# EAGLE design TurnoutModule (EAGLE 7.6.0)
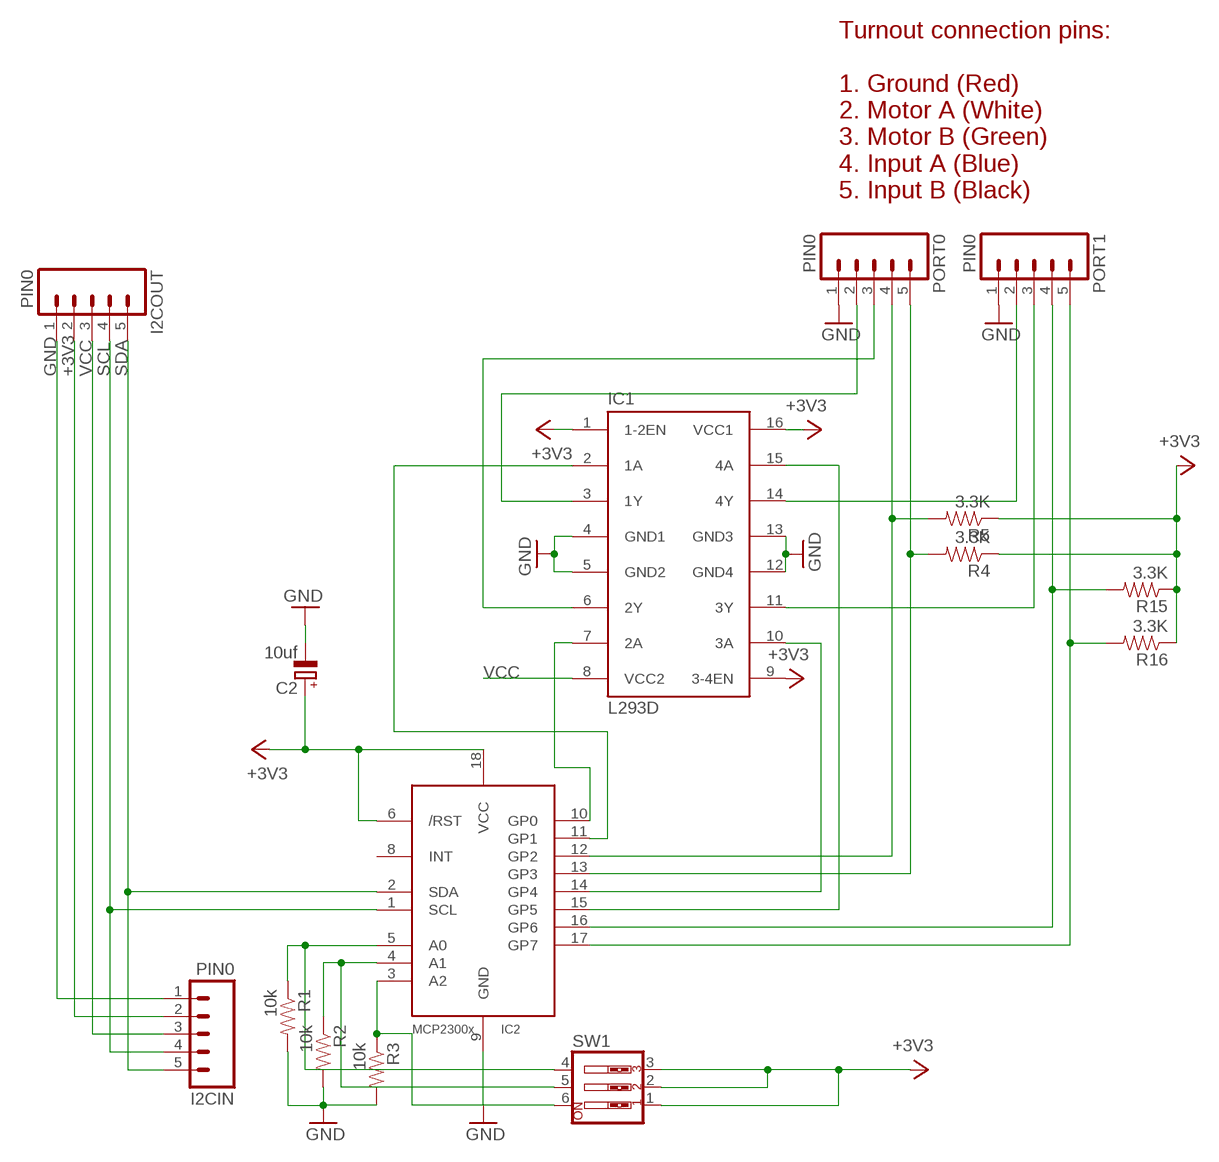
[diagram p0: schematic, sheet 1]

## Parts
C2  10uf  CPOL-EUE2.5-6  [E2,5-6]
I2CIN  PIN0  M05  [05P]
I2COUT  PIN0  M05  [05P]
IC1  L293D  [DIL16]
IC2  MCP23008/P  [DIL18]
PORT0  PIN0  M05  [05P]
PORT1  PIN0  M05  [05P]
R1  10k  RESISTORPTH-1/4W  [AXIAL-0.4]
R2  10k  RESISTORPTH-1/4W  [AXIAL-0.4]
R3  10k  RESISTORPTH-1/4W  [AXIAL-0.4]
R4  3.3K  RESISTORPTH-1/4W  [AXIAL-0.4]
R5  3.3K  RESISTORPTH-1/4W  [AXIAL-0.4]
R15  3.3K  RESISTORPTH-1/4W  [AXIAL-0.4]
R16  3.3K  RESISTORPTH-1/4W  [AXIAL-0.4]
SW1  SW_DIP-3  [EDG-03]

## Nets
+3V3: C2.+ I2CIN.2 I2COUT.2 IC1.1(1-2EN) IC1.9(3-4EN) IC1.16(VCC1) IC2.6(/RST) IC2.18(VCC) R4.P$1 R5.P$1 R15.P$1 R16.P$1 SW1.1 SW1.2 SW1.3
GND: C2.- I2CIN.1 I2COUT.1 IC1.4(GND1) IC1.5(GND2) IC1.12(GND4) IC1.13(GND3) IC2.9(GND) PORT0.1 PORT1.1 R1.P$2 R2.P$2 R3.P$2
N$1: IC2.5(A0) R1.P$1 SW1.4
N$2: IC2.17(GP7) PORT1.5 R16.P$2
N$3: IC1.3(1Y) PORT0.2
N$4: IC2.4(A1) R2.P$1 SW1.5
N$5: IC2.16(GP6) PORT1.4 R15.P$2
N$6: IC1.6(2Y) PORT0.3
N$7: IC2.3(A2) R3.P$1 SW1.6
N$8: IC1.7(2A) IC2.10(GP0)
N$9: IC1.2(1A) IC2.11(GP1)
N$10: IC1.14(4Y) PORT1.2
N$12: IC2.12(GP2) PORT0.4 R5.P$2
N$13: IC1.11(3Y) PORT1.3
N$15: IC1.10(3A) IC2.14(GP4)
N$17: IC1.15(4A) IC2.15(GP5)
N$29: IC2.13(GP3) PORT0.5 R4.P$2
SCL: I2CIN.4 I2COUT.4 IC2.1(SCL)
SDA: I2CIN.5 I2COUT.5 IC2.2(SDA)
VCC: I2CIN.3 I2COUT.3 IC1.8(VCC2)
Unconnected: IC2.8(INT)

## Notes on the sheet
- Turnout connection pins:
  
  1. Ground (Red)
  2. Motor A (White)
  3. Motor B (Green)
  4. Input A (Blue)
  5. Input B (Black)

## Library data of the parts
C2 = rcl:CPOL-EU: POLARIZED CAPACITOR, European symbol
I2CIN I2COUT PORT0 PORT1 = con-amp-quick:M05: AMP QUICK CONNECTOR; OC_FARNELL: unknown; OC_NEWARK: unknown
IC1 = st-microelectronics:L293D: PUSH-PULL 4 CHANNEL DRIVER; MPN: L293D; OC_FARNELL: 9589619; OC_NEWARK: 56P8249
IC2 = adafruit:MCP23008: MCP23008 Inexpensive i2c i/o expander - 8 general purpose i/o pins with optional pullups
R1-R5 R15 R16 = SparkFun-Resistors:RESISTOR: Resistor Basic schematic elements and footprints for 0603, 1206, and PTH resistors.
SW1 = special:SW_DIP-3: DIP SWITCH

## Board
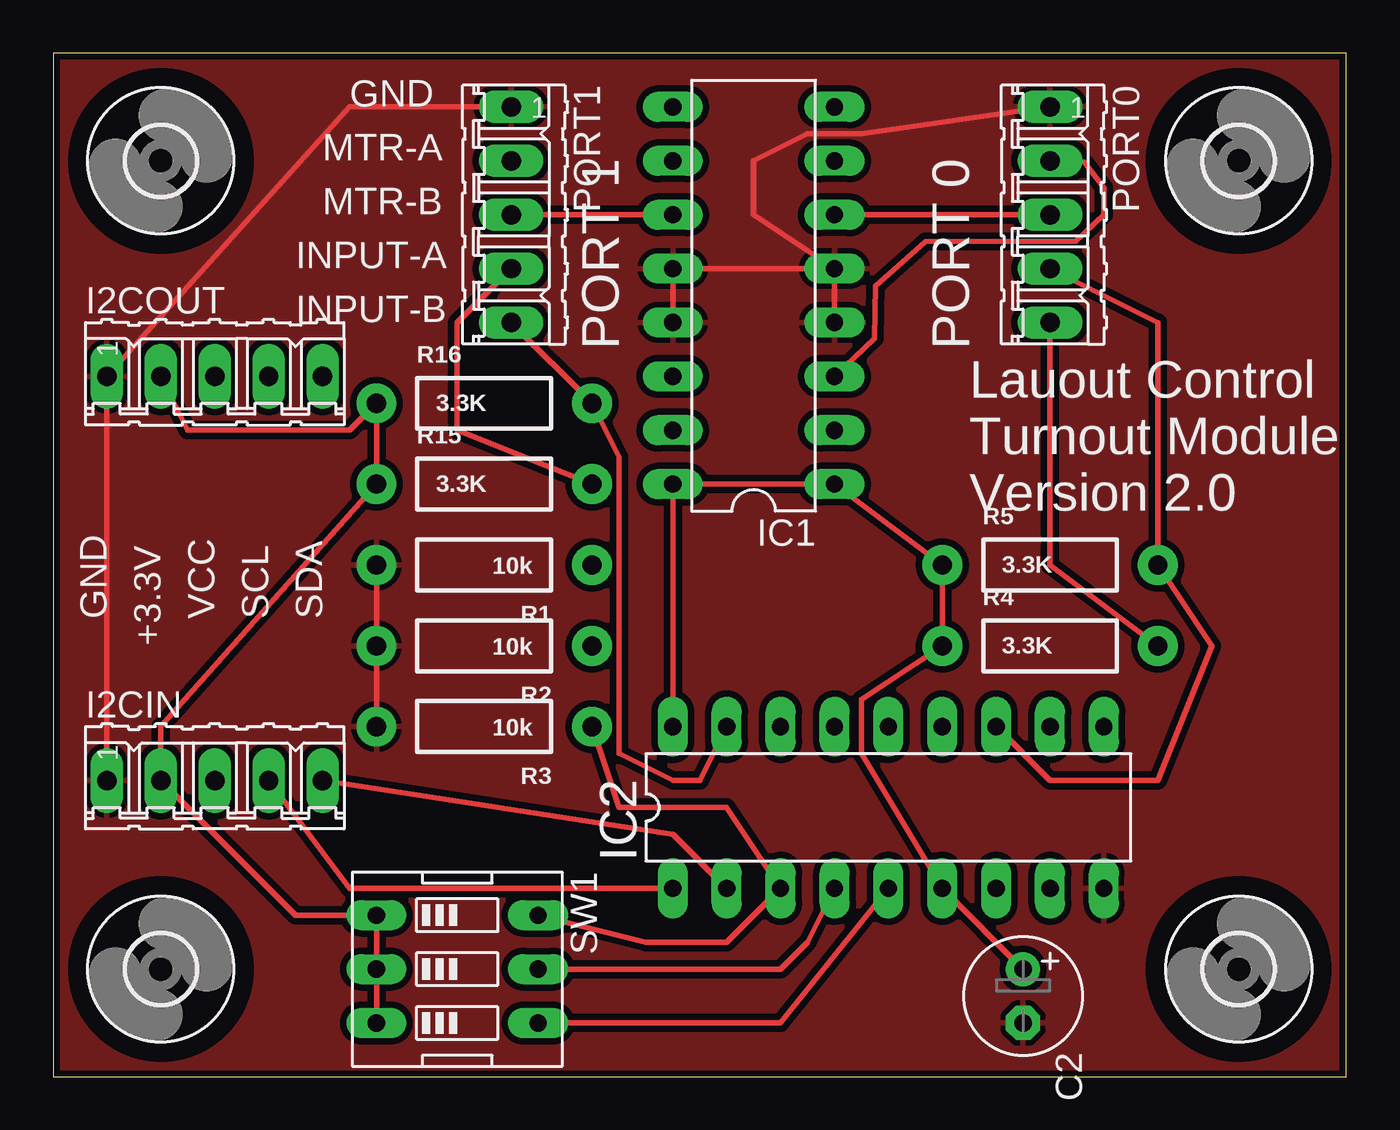
[diagram p1: board, top side]
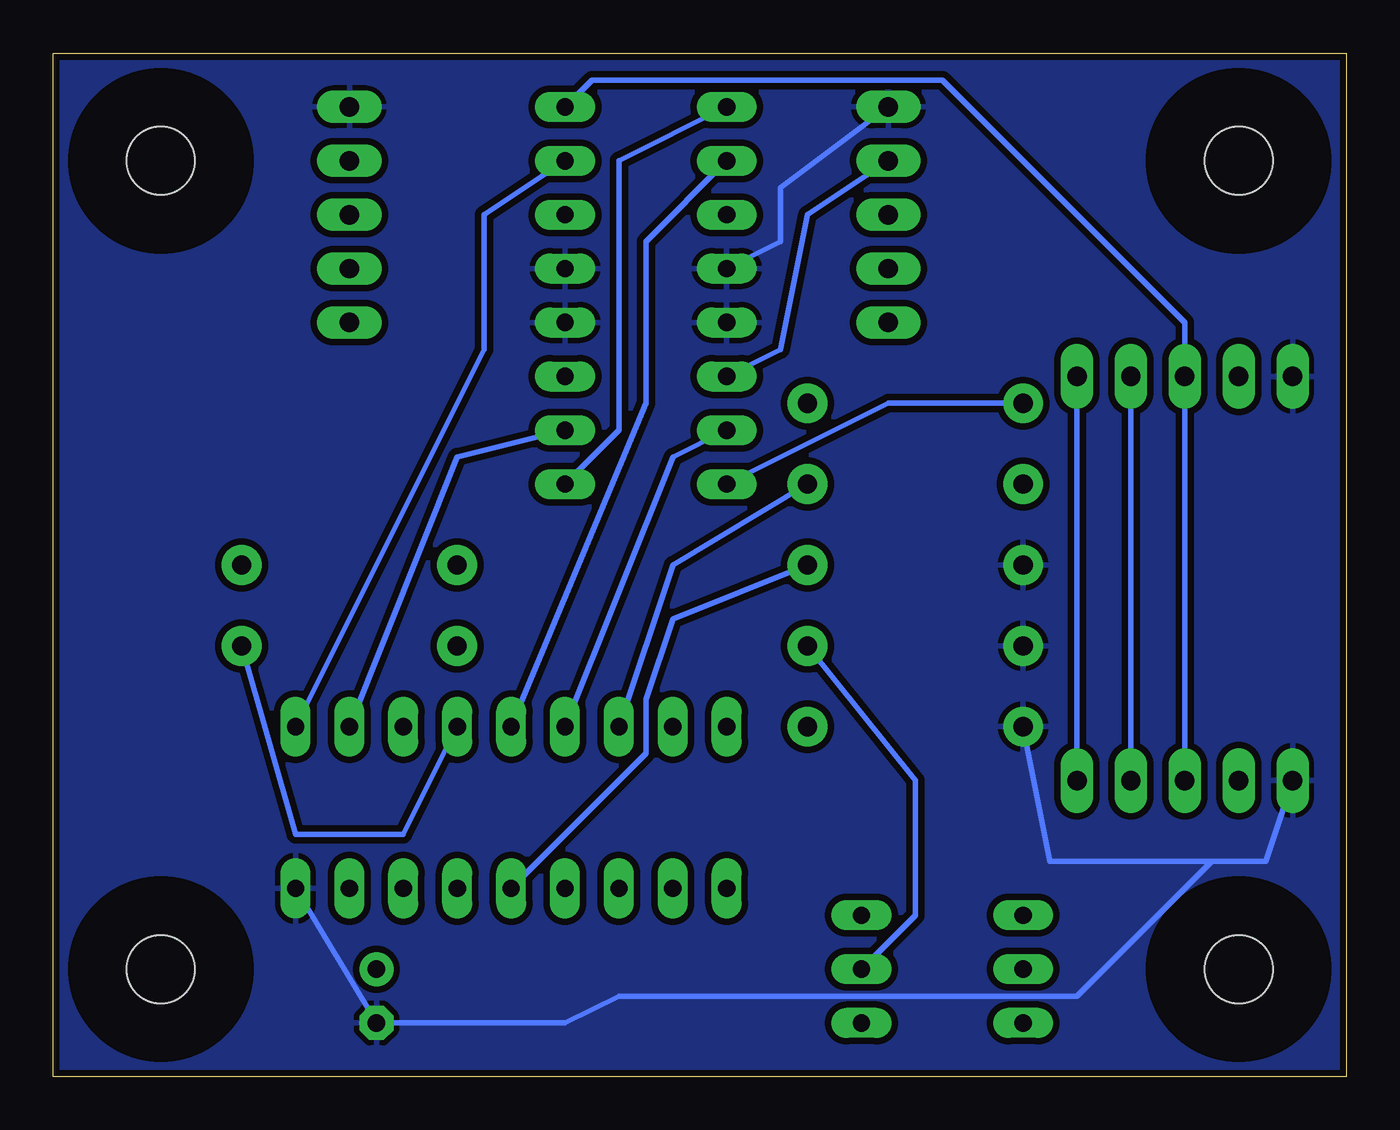
[diagram p2: board, bottom side, seen from below]

Size 60.96 x 48.26 mm. Coordinates in mm from the lower left corner, seen from the top.
Outline: 0,0 60.96,0 60.96,48.26 0,48.26 0,0
Copper layers (1*16): Top 0.035mm / dielectric 1.5mm / Bottom 0.035mm
Design rules "SparkFun": minimum track width 8mil, minimum drill 20mil, track to track 8mil, track to pad 8mil, pad to pad 8mil, via to via 8mil, smd to smd 8mil, copper to edge 8mil, drill to drill 8mil, minimum pad ring 12mil, minimum via ring 10mil, stop-mask expansion 4mil, vias tented up to drill 20mil, thermal gap 10mil

### Footprints (pad centres in the part's own frame; a part is rotated, then mirrored left to right if it is on the bottom)
E2,5-6 = drill 0.813 pad 1.6: + -1.27,0 | drill 0.813 pad 1.6 octagon: - 1.27,0
05P = drill 0.914 long: 1 -5.08,0; 2 -2.54,0; 3 0,0; 4 2.54,0; 5 5.08,0
DIL16 = drill 0.813 long: 1 -8.89,-3.81; 2 -6.35,-3.81; 3 -3.81,-3.81; 4 -1.27,-3.81; 5 1.27,-3.81; 6 3.81,-3.81; 7 6.35,-3.81; 8 8.89,-3.81; 9 8.89,3.81; 10 6.35,3.81; 11 3.81,3.81; 12 1.27,3.81; 13 -1.27,3.81; 14 -3.81,3.81; 15 -6.35,3.81; 16 -8.89,3.81
DIL18 = drill 0.813 long: 1 -10.16,-3.81; 2 -7.62,-3.81; 3 -5.08,-3.81; 4 -2.54,-3.81; 5 0,-3.81; 6 2.54,-3.81; 7 5.08,-3.81; 8 7.62,-3.81; 9 10.16,-3.81; 10 10.16,3.81; 11 7.62,3.81; 12 5.08,3.81; 13 2.54,3.81; 14 0,3.81; 15 -2.54,3.81; 16 -5.08,3.81; 17 -7.62,3.81; 18 -10.16,3.81
AXIAL-0.4 = drill 0.9 pad 1.88: P$1 -5.08,0; P$2 5.08,0
EDG-03 = drill 0.813 long: 1 -2.54,-3.81; 2 0,-3.81; 3 2.54,-3.81; 4 2.54,3.81; 5 0,3.81; 6 -2.54,3.81
3,2 = hole 3.2: 0,0

### Placement (x,y rotation side)
C2  45.72,3.81 270 top
I2CIN  7.62,13.97 0 top
I2COUT  7.62,33.02 0 top
IC1  33.02,36.83 90 top
IC2  39.37,12.7 0 top
PORT0  46.99,40.64 270 top
PORT1  21.59,40.64 270 top
R1  20.32,24.13 180 top
R2  20.32,20.32 180 top
R3  20.32,16.51 180 top
R4  46.99,20.32 0 top
R5  46.99,24.13 0 top
R15  20.32,27.94 0 top
R16  20.32,31.75 0 top
SW1  19.05,5.08 270 top
U$2  [3,2]  5.08,43.18 0 top
U$3  [3,2]  55.88,43.18 0 top
U$4  [3,2]  5.08,5.08 0 top
U$5  [3,2]  55.88,5.08 0 top

### Tracks (layer width: path | path; a pad name or v marks a point on that pad's centre or on a via)
+3V3
  Top 0.254: IC2.18 IC1.16 IC1.1 R5.P$1 R4.P$1 38.1,17.78 38.1,15.24 IC2.6 C2.+ | I2COUT.2 6.35,30.48 13.97,30.48 R16.P$1 R15.P$1 5.08,16.51 I2CIN.2 11.43,7.62 SW1.1 SW1.2 SW1.3
  Bottom 0.254: IC1.9 34.29,43.18 34.29,30.48 IC1.1 | R16.P$1 21.59,31.75 IC1.16
GND
  Top 0.254: IC1.13 IC1.12 IC1.5 | IC1.4 IC1.5 | I2CIN.1 I2COUT.1 13.97,45.72 PORT1.1 | PORT0.1 38.1,44.45 35.56,44.45 33.02,43.18 33.02,40.64 IC1.5 | R3.P$2 R2.P$2 R1.P$2
  Bottom 0.254: PORT1.1 26.67,41.91 26.67,39.37 IC1.12 | R3.P$2 13.97,10.16 6.35,10.16 | 6.35,10.16 3.81,10.16 I2CIN.1 | 6.35,10.16 12.7,3.81 34.29,3.81 36.83,2.54 C2.- IC2.9
  pour Top (isolate 0.305): 0,0 0,48.26 60.96,48.26 60.96,0
  pour Bottom (isolate 0.305): 0,0 0,48.26 60.96,48.26 60.96,0
N$1
  Top 0.254: SW1.4 34.29,2.54 IC2.5
  Bottom 0.254: R1.P$1 31.75,21.59 33.02,17.78 33.02,15.24 IC2.5
N$2
  Top 0.254: PORT1.5 R16.P$2 26.67,29.21 26.67,15.24 29.21,13.97 30.48,13.97 IC2.17
N$3
  Top 0.254: IC1.3 38.72,34.8 38.77,37.28 41.13,39.37 48.2,39.39 49.53,40.64 49.53,41.91 48.62,43.11 PORT0.2
N$4
  Top 0.254: SW1.5 34.29,5.08 35.56,6.35 IC2.4
  Bottom 0.254: R2.P$1 20.32,13.97 20.32,7.62 SW1.5
N$5
  Top 0.254: R15.P$2 19.05,30.48 19.05,35.56 PORT1.4
  Bottom 0.254: R15.P$2 31.75,24.13 IC2.16
N$6
  Top 0.254: IC1.6 PORT0.3
N$7
  Top 0.254: R3.P$1 26.67,12.7 31.75,12.7 IC2.3 31.75,6.35 27.94,6.35 SW1.6
N$8
  Bottom 0.254: IC2.10 40.64,34.29 40.64,40.64 IC1.7
N$9
  Bottom 0.254: IC2.11 41.91,29.21 IC1.2
N$10
  Bottom 0.254: IC1.14 26.67,34.29 25.4,40.64 PORT1.2
N$12
  Top 0.254: IC2.12 46.99,13.97 52.07,13.97 54.61,20.32 R5.P$2 52.07,35.56 PORT0.4
N$13
  Top 0.254: IC1.11 PORT1.3
N$15
  Bottom 0.254: IC2.14 33.02,31.75 33.02,39.37 IC1.10
N$17
  Bottom 0.254: IC2.15 31.75,29.21 IC1.15
N$29
  Top 0.254: R4.P$2 46.99,24.13 PORT0.5
  Bottom 0.254: IC2.13 44.45,11.43 49.53,11.43 R4.P$2
SCL
  Top 0.254: IC2.1 13.97,8.89 I2CIN.4
  Bottom 0.254: I2COUT.4 I2CIN.4
SDA
  Top 0.254: IC2.2 29.21,11.43 I2CIN.5
  Bottom 0.254: I2COUT.5 I2CIN.5
VCC
  Bottom 0.254: I2CIN.3 I2COUT.3 7.62,35.56 19.05,46.99 35.56,46.99 IC1.8

### Text on the board
tPlace: GND | MTR-A | MTR-B | INPUT-A | INPUT-B | PORT 1 | PORT 0 | Lauout Control / Turnout Module / Version 2.0 | GND | VCC | SCL | SDA | +3.3V